# Altium schematic sheet Amplifier.SchDoc
size A4; SheetNumber: 3; SheetTotal: 3
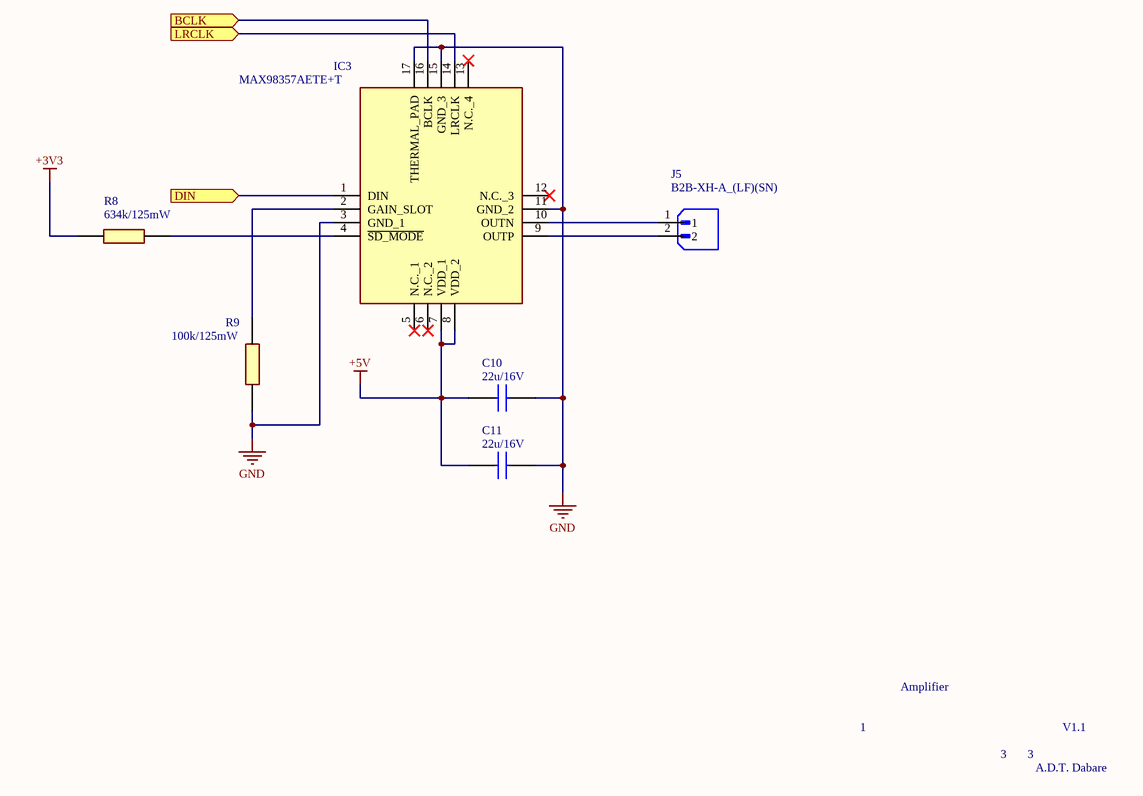
[diagram p0: Amplifier.SchDoc]

## Parts
C10  22u/16V  [C0805]
C11  22u/16V  [CAPC2012X94N]
IC3  MAX98357AETE+T  [QFN50P300X300X80-17N]
J5  B2B-XH-A_(LF)(SN)  [JST_B2B-XH-A_(LF)(SN)]
R8  634k/125mW  [RESC2012X50N]
R9  100k/125mW  [ERA6AEB101V]

## Ports
BCLK (in, see ESP32[2C]), DIN (in, see ESP32[2C]), LRCLK (in, see ESP32[2C])

## Nets
+3V3: R8.1
+5V: C10.1 C11.1 IC3.7(VDD_1) IC3.8(VDD_2)
GND: C10.2 C11.2 IC3.3(GND_1) IC3.11(GND_2) IC3.15(GND_3) IC3.17(THERMAL_PAD) R9.1
BCLK: IC3.16(BCLK) ; port BCLK
DIN: IC3.1(DIN) ; port DIN
LRCLK: IC3.14(LRCLK) ; port LRCLK
NetIC3_2: IC3.2(GAIN_SLOT) R9.2
NetIC3_4: IC3.4(~{SD_MODE}) R8.2
NetIC3_9: IC3.9(OUTP) J5.2
NetIC3_10: IC3.10(OUTN) J5.1

Not connected (* = marked no-connect by the designer): IC3 5(N.C._1)* 6(N.C._2)* 12(N.C._3)* 13(N.C._4)*

## Notes on the sheet
- Amplifier
- 1
- 3
- V1.1
- A.D.T. Dabare

## Library data of the parts
C10 = C0805X104K4RACAUTO: Multilayer Ceramic Capacitors MLCC - SMD/SMT 16V 0.1uF X7R 0805 10% Flex AEC-Q200; Manufacturer_Name: KEMET; Datasheet Link: https://content.kemet.com/datasheets/KEM_C1078_X7R_FT-CAP_AUTO_SMD.pdf; Height: 1.1mm; Manufacturer_Part_Number: C0805X104K4RACAUTO; Mouser Part Number: 80-C0805X104K4RAUTO; Mouser Price/Stock: https://www.mouser.co.uk/ProductDetail/KEMET/C0805X104K4RACAUTO?qs=PqoDHHvF64%2FAA39kqwjnIA%3D%3D; Arrow Part Number: C0805X104K4RACAUTO; Arrow Price/Stock: https://www.arrow.com/en/products/c0805x104k4racauto/kemet-corporation?utm_currency=USD&region=nac
C11 = 0805YC106KAT2A: Multilayer Ceramic Capacitors MLCC - SMD/SMT KGM21AR71C106KU NEW GLOBAL PN 16V 10uF X A 581-KGM21AR71C106KU; Manufacturer_Name: Kyocera AVX; Datasheet Link: https://www.mouser.fr/datasheet/2/40/AVX_X7RDielectric_777024-1853642.pdf; Height: 0.94mm; Manufacturer_Part_Number: 0805YC106KAT2A; Mouser Part Number: 581-0805YC106KAT2A; Mouser Price/Stock: https://www.mouser.co.uk/ProductDetail/KYOCERA-AVX/0805YC106KAT2A?qs=3HJ2avRr9PKwMzeRMZhF2g%3D%3D; Arrow Part Number: 0805YC106KAT2A; Arrow Price/Stock: https://www.arrow.com/en/products/0805yc106kat2a/avx?region=nac
IC3 = MAX98357AETE+T: Audio Amplifiers Digital Input Class D Amplifier; Manufacturer_Name: Analog Devices; Datasheet Link: https://datasheets.maximintegrated.com/en/ds/MAX98357A-MAX98357B.pdf; Height: 0.8mm; Manufacturer_Part_Number: MAX98357AETE+T; Mouser Part Number: 700-MAX98357AETE+T; Mouser Price/Stock: https://www.mouser.co.uk/ProductDetail/Analog-Devices-Maxim-Integrated/MAX98357AETE%2bT?qs=AAveGqk956HhNpoJjF5x2g%3D%3D; Arrow Part Number: MAX98357AETE+T; Arrow Price/Stock: https://www.arrow.com/en/products/max98357aetet/analog-devices?region=nac
J5 = B2B-XH-A_(LF)(SN): Connector Header Through Hole 2 position 0.098 (2.50mm); MF: JST Sales; MP: B2B-XH-A (LF)(SN); SnapEDA_Link: https://www.snapeda.com/parts/B2B-XH-A%20(LF)(SN)/JST+Sales+America+Inc./view-part/?ref=snap; Package: None; Value: *; Check_prices: https://www.snapeda.com/parts/B2B-XH-A%20(LF)(SN)/JST+Sales+America+Inc./view-part/?ref=eda
R8 = CRCW0805634KFKEA: Thick Film Resistors - SMD 1/8watt 634Kohms 1%; Manufacturer_Name: Vishay; Datasheet Link: http://www.vishay.com/docs/20035/dcrcwe3.pdf; Height: 0.5mm; Manufacturer_Part_Number: CRCW0805634KFKEA; Mouser Part Number: 71-CRCW0805634KFKEA; Mouser Price/Stock: https://www.mouser.com/Search/ProductDetail.aspx?qs=EhwKGB4UJflfbl5wVdh81Q%3d%3d
R9 = ERA-6AED104V: Thin Film Resistors - SMD 0805 100Kohms 25ppm 0.5% AEC-Q200; Manufacturer_Name: Panasonic; Datasheet Link: https://industrial.panasonic.com/cdbs/www-data/pdf/RDM0000/AOA0000C307.pdf; Height: 0.6mm; Manufacturer_Part_Number: ERA-6AED104V; Mouser Part Number: 667-ERA-6AED104V; Mouser Price/Stock: https://www.mouser.com/Search/Refine.aspx?Keyword=667-ERA-6AED104V